# EAGLE design POW_HUB (EAGLE 7.6.0)
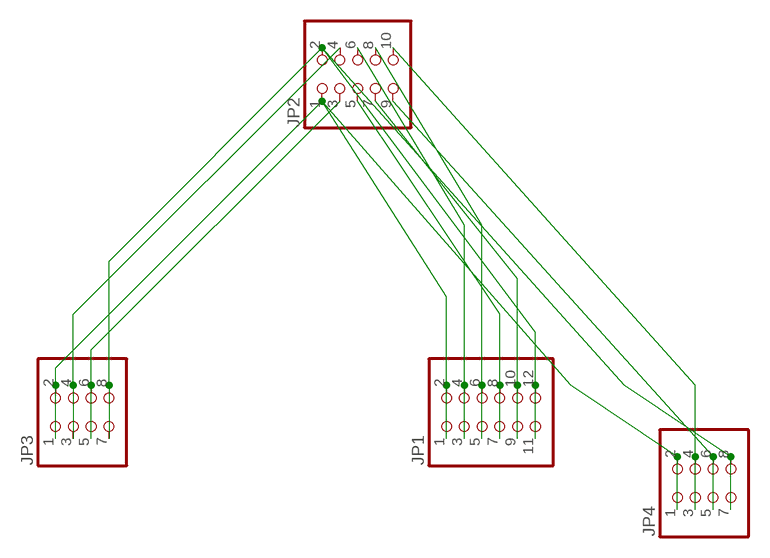
[diagram p0: schematic, sheet 1]

## Parts
JP1  PINHD-2X6  [2X06]
JP2  PINHD-2X5  [2X05]
JP3  PINHD-2X4  [2X04]
JP4  PINHD-2X4  [2X04]

## Nets
N$1: JP1.1 JP1.2 JP2.1 JP3.1 JP3.2 JP4.1 JP4.2
N$2: JP1.11 JP1.12 JP2.2 JP3.7 JP3.8 JP4.7 JP4.8
N$3: JP2.3 JP3.5 JP3.6
N$4: JP2.4 JP3.3 JP3.4
N$5: JP1.3 JP1.4 JP2.6
N$6: JP1.5 JP1.6 JP2.8
N$7: JP1.7 JP1.8 JP2.5
N$8: JP1.9 JP1.10 JP2.7
N$9: JP2.10 JP4.3 JP4.4
N$10: JP2.9 JP4.5 JP4.6

## Library data of the parts
JP1 = pinhead:PINHD-2X6: PIN HEADER
JP2 = pinhead:PINHD-2X5: PIN HEADER
JP3 JP4 = pinhead:PINHD-2X4: PIN HEADER

## Net classes
0 default: width 0.254 mm, drill 0.508 mm, clearance 0.254 mm

## Board
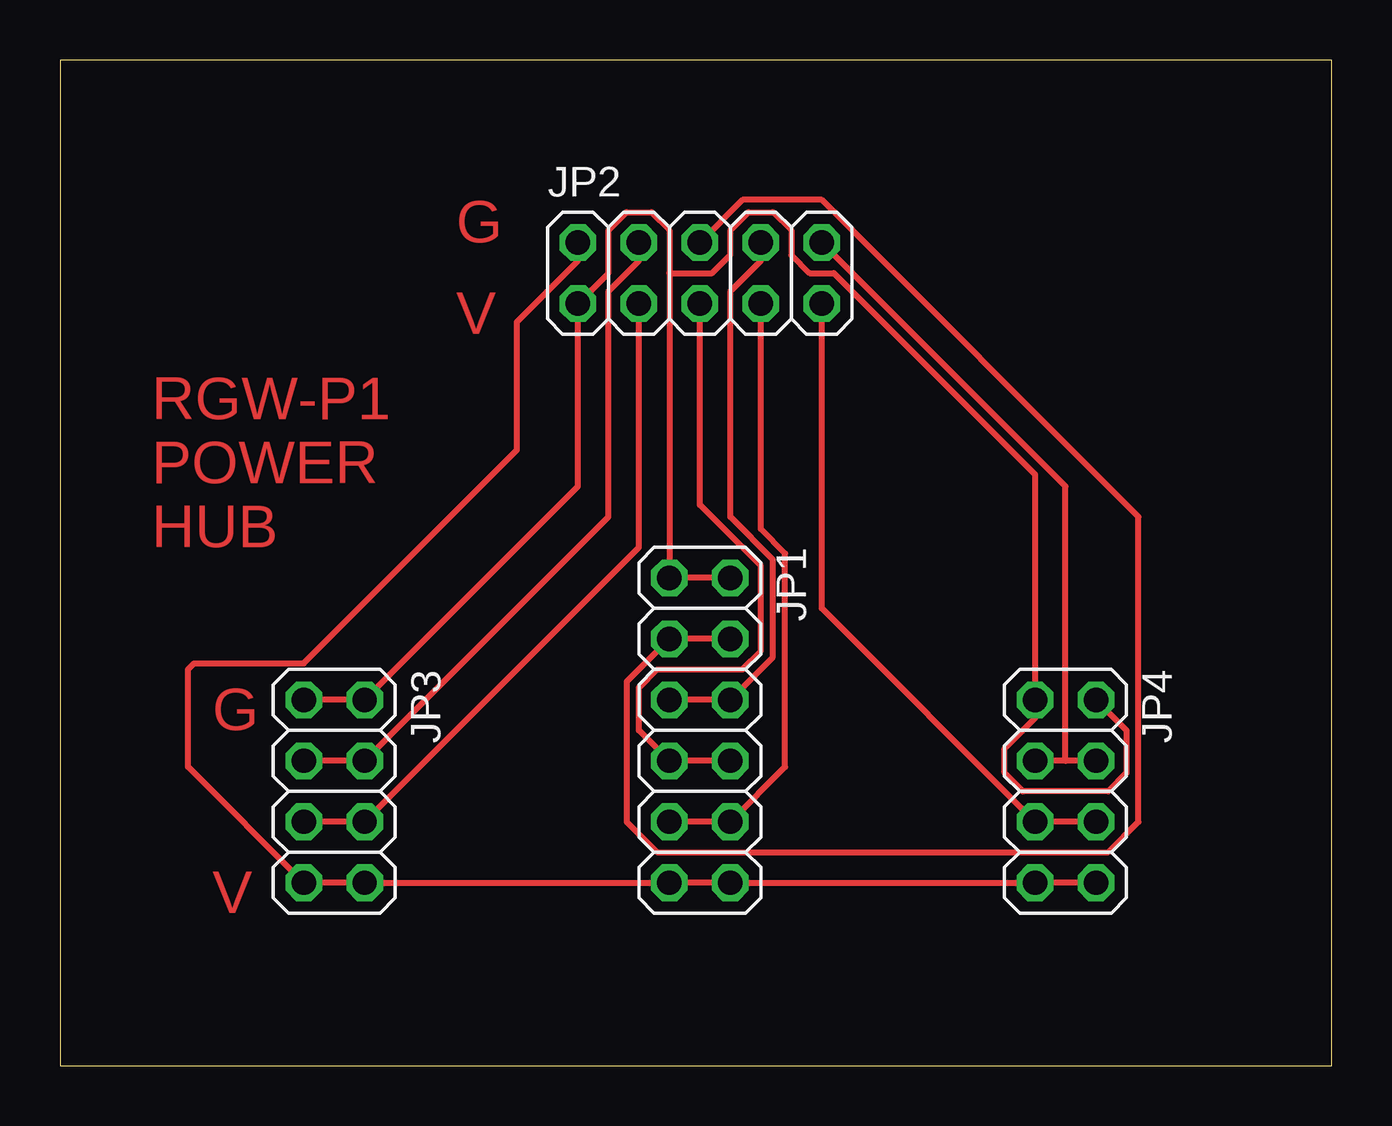
[diagram p1: board, top side]

Size 53.01 x 41.9 mm. Coordinates in mm from the lower left corner, seen from the top.
Outline: 0,0 53.01,0 53.01,41.9 0,41.9 0,0
Copper layers (1*16): Top 0.035mm / dielectric 1.5mm / Bottom 0.035mm
Design rules "default": minimum track width 10mil, minimum drill 24mil, track to track 8mil, track to pad 8mil, pad to pad 8mil, via to via 8mil, smd to smd 8mil, copper to edge 40mil, drill to drill 8mil, minimum pad ring 10mil, minimum via ring 8mil, stop-mask expansion 4mil, vias tented up to drill 0mil, thermal gap 10mil

### Footprints (pad centres in the part's own frame; a part is rotated, then mirrored left to right if it is on the bottom)
2X06 = drill 1.016 octagon: 1 -6.35,-1.27; 2 -6.35,1.27; 3 -3.81,-1.27; 4 -3.81,1.27; 5 -1.27,-1.27; 6 -1.27,1.27; 7 1.27,-1.27; 8 1.27,1.27; 9 3.81,-1.27; 10 3.81,1.27; 11 6.35,-1.27; 12 6.35,1.27
2X05 = drill 1.016 octagon: 1 -5.08,-1.27; 2 -5.08,1.27; 3 -2.54,-1.27; 4 -2.54,1.27; 5 0,-1.27; 6 0,1.27; 7 2.54,-1.27; 8 2.54,1.27; 9 5.08,-1.27; 10 5.08,1.27
2X04 = drill 1.016 octagon: 1 -3.81,-1.27; 2 -3.81,1.27; 3 -1.27,-1.27; 4 -1.27,1.27; 5 1.27,-1.27; 6 1.27,1.27; 7 3.81,-1.27; 8 3.81,1.27

### Placement (x,y rotation side)
JP1  26.67,13.97 270 top
JP2  26.67,33.02 0 top
JP3  11.43,11.43 270 top
JP4  41.91,11.43 270 top

### Tracks (layer width: path | path; a pad name or v marks a point on that pad's centre or on a via)
N$1
  Top 0.254: JP4.2 44.45,13.97 44.45,12.19 43.69,11.43 40.13,11.43 39.37,12.19 39.37,13.21 40.64,14.48 JP4.1 40.64,24.64 32.26,33.02 31.24,33.02 30.48,33.78 30.48,34.8 29.72,35.56 28.7,35.56 27.94,34.8 27.94,33.78 27.18,33.02 25.4,33.02 | JP1.2 JP1.1 25.4,33.02 | JP3.1 JP3.2 21.59,24.13 JP2.1 22.86,33.02 22.86,34.8 23.62,35.56 24.64,35.56 25.4,34.8 25.4,33.02
N$2
  Top 0.254: JP4.8 JP4.7 JP1.12 JP1.11 JP3.8 JP3.7 5.33,12.45 5.33,16.51 5.59,16.76 10.16,16.76 19.05,25.65 19.05,30.99 21.59,33.53 JP2.2
N$3
  Top 0.254: JP3.5 JP3.6 24.13,21.59 JP2.3
N$4
  Top 0.254: JP3.3 JP3.4 22.86,22.86 22.86,32.26 24.13,33.53 JP2.4
N$5
  Top 0.254: JP1.4 JP1.3 23.62,16 23.62,10.16 24.89,8.89 43.69,8.89 44.96,10.16 44.96,22.86 31.75,36.07 28.45,36.07 JP2.6
N$6
  Top 0.254: JP1.5 JP1.6 29.72,17.02 29.72,21.08 27.94,22.86 27.94,32.26 29.21,33.53 JP2.8
N$7
  Top 0.254: JP1.8 JP1.7 24.13,13.97 24.13,15.75 24.89,16.51 28.45,16.51 29.21,17.27 29.21,20.83 26.67,23.37 JP2.5
N$8
  Top 0.254: JP1.9 JP1.10 30.23,12.45 30.23,21.34 29.21,22.35 JP2.7
N$9
  Top 0.254: JP4.4 41.91,12.7 | 41.91,12.7 JP4.3 | JP2.10 41.91,24.13 41.91,12.7
N$10
  Top 0.254: JP4.6 JP4.5 31.75,19.05 JP2.9

### Text on the board
Top: G | V | RGW-P1 / POWER / HUB | G | V